# Altium project ESP32_Pico.PrjPcb
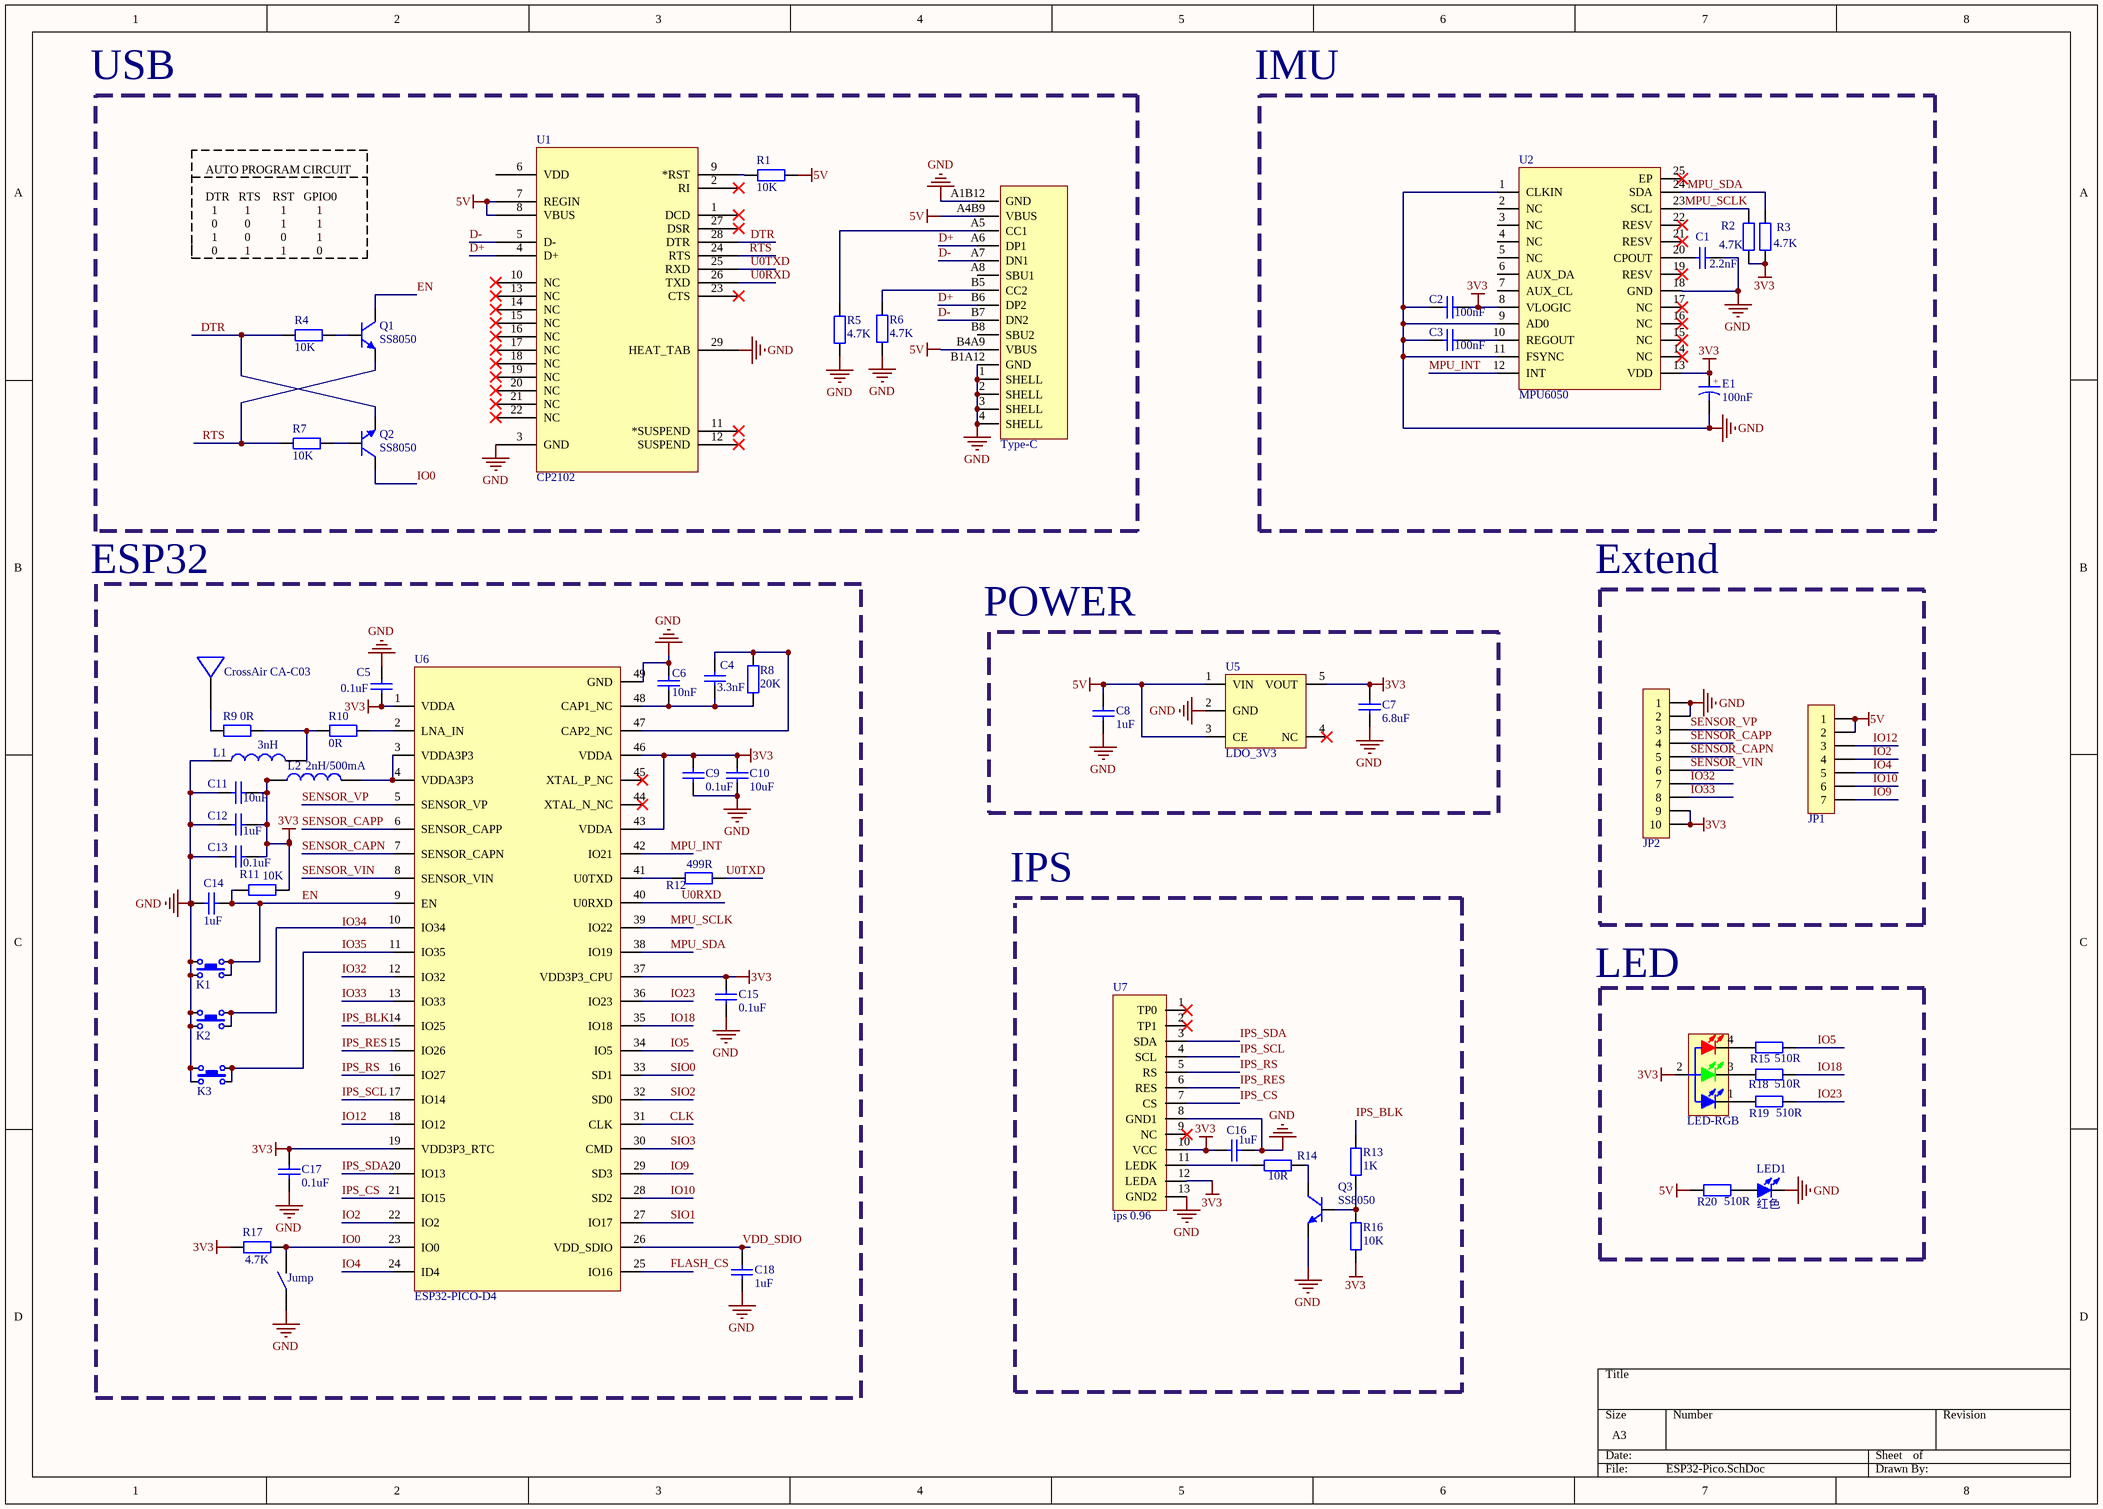
[diagram p0: ESP32-Pico.SchDoc]
1 sheet, 59 parts. Net scope: global (net labels, ports and power ports of the same name join across sheets).
Board file: ESP32-Pico.PcbDoc

## Sheet ESP32-Pico.SchDoc
size A3; SheetNumber: 1; SheetTotal: 1

### Parts
*1  Jump  [Jump]
C1  2.2nF  [C0402_L]
C2  100nF  [C0402_L]
C3  100nF  [C0402_L]
C4  3.3nF  [C0402_L]
C5  0.1uF  [C0402_L]
C6  10nF  [C0402_L]
C7  6.8uF  [C0603_L]
C8  1uF  [C0402_L]
C9  0.1uF  [C0402_L]
C10  10uF  [C0402_L]
C11  10uF  [C0402_L]
C12  1uF  [C0402_L]
C13  0.1uF  [C0402_L]
C14  1uF  [C0402_L]
C15  0.1uF  [C0402_L]
C16  1uF  [C0402_L]
C17  0.1uF  [C0402_L]
C18  1uF  [C0402_L]
E1  100nF  [C_3216]
JP1  HDR-1X7  [HDR2.54-7P]  (value not drawn)
JP2  HDR-1X10  [HDR2.54-10P]  (value not drawn)
K1  (no value)  [ButtonTACT_3.5*3.55_90]
K2  (no value)  [ButtonTACT_3.5*3.55_90]
K3  (no value)  [ButtonTACT_3.5*3.55_90]
L1  3nH  [L0402]
L2  2nH/500mA  [L0402]
LED1  红色  [LED0402]
Q1  SS8050  [SOT23-3N]
Q2  SS8050  [SOT23-3N]
Q3  SS8050  [SOT23-3N]
R1  10K  [R0402_L]
R2  4.7K  [R0402_L]
R3  4.7K  [R0402_L]
R4  10K  [R0402_L]
R5  4.7K  [R0402_L]
R6  4.7K  [R0402_L]
R7  10K  [R0402_L]
R8  20K  [R0402_L]
R9  0R  [R0402_L]
R10  0R  [R0402_L]
R11  10K  [R0402_L]
R12  499R  [R0402_L]
R13  1K  [R0402_L]
R14  10R  [R0603_L]
R15  510R  [R0402_L]
R16  10K  [R0402_L]
R17  4.7K  [R0402_L]
R18  510R  [R0402_L]
R19  510R  [R0402_L]
R20  510R  [R0402_L]
U1  CP2102  [CP2102]
U2  MPU6050  [MPU6050]
U3  Type-C  [Type-C 16P]
U4  CrossAir CA-C03  [CrossAir CA-C03]
U5  LDO_3V3  [SSP7603P33M5R]
U6  ESP32-PICO-D4  [ESP32-PICO-D4]
U7  ips 0.96  [ips 0.96]
U8  LED-RGB  [LED-RGB]

### Nets
3V3: C2.1 C5.2 C7.2 C9.2 C10.2 C11.2 C12.2 C13.2 C15.2 C16.1 C17.2 E1.1(A) JP2.9 JP2.10 L2.1 R2.2 R3.2 R11.2 R16.2 R17.1 U2.8(VLOGIC) U2.13(VDD) U5.5(VOUT) U6.1(VDDA) U6.19(VDD3P3_RTC) U6.37(VDD3P3_CPU) U6.43(VDDA) U6.46(VDDA) U7.10(VCC) U7.12(LEDA) U8.2(A)
5V: C8.2 JP1.1 JP1.2 R1.2 R20.1 U1.7(REGIN) U1.8(VBUS) U3.A4B9(VBUS) U3.B4A9(VBUS) U5.1(VIN) U5.3(CE)
GND: *1.1 C1.2 C2.2 C3.2 C5.1 C6.1 C7.1 C8.1 C9.1 C10.1 C11.1 C12.1 C13.1 C14.2 C15.1 C16.2 C17.1 C18.2 E1.2(K) JP2.1 JP2.2 K1.1 K1.3 K2.1 K2.3 K3.1 K3.3 L1.1 LED1.2(K) Q3.2(E) R5.2 R6.2 U1.3(GND) U1.29(HEAT_TAB) U2.1(CLKIN) U2.9(AD0) U2.11(FSYNC) U2.18(GND) U3.1(SHELL) U3.2(SHELL) U3.3(SHELL) U3.4(SHELL) U3.A1B12(GND) U3.B1A12(GND) U5.2(GND) U6.49(GND) U7.8(GND1) U7.13(GND2)
CLK: U6.31(CLK)
D+: U1.4(D+) U3.A6(DP1) U3.B6(DP2)
D-: U1.5(D-) U3.A7(DN1) U3.B7(DN2)
DTR: Q2.2(E) R4.2 U1.28(DTR)
EN: C14.1 K1.2 K1.4 Q1.3(C) R11.1 U6.9(EN)
IO0: *1.2 Q2.3(C) R17.2 U6.23(IO0)
IO2: JP1.4 U6.22(IO2)
IO4: JP1.5 U6.24(ID4)
IO5: R15.2 U6.34(IO5)
IO9: JP1.7 U6.29(SD3)
IO10: JP1.6 U6.28(SD2)
IO12: JP1.3 U6.18(IO12)
IO18: R18.2 U6.35(IO18)
IO23: R19.2 U6.36(IO23)
IO32: JP2.7 U6.12(IO32)
IO33: JP2.8 U6.13(IO33)
IO35: K3.2 K3.4 U6.11(IO35)
IPS_BLK: R13.2 U6.14(IO25)
IPS_CS: U6.21(IO15) U7.7(CS)
IPS_RES: U6.15(IO26) U7.6(RES)
IPS_RS: U6.16(IO27) U7.5(RS)
IPS_SCL: U6.17(IO14) U7.4(SCL)
IPS_SDA: U6.20(IO13) U7.3(SDA)
MPU_INT: U2.12(INT) U6.42(IO21)
MPU_SCLK: R2.1 U2.23(SCL) U6.39(IO22)
MPU_SDA: R3.1 U2.24(SDA) U6.38(IO19)
RTS: Q1.2(E) R7.2 U1.24(RTS)
SENSOR_CAPN: JP2.5 U6.7(SENSOR_CAPN)
SENSOR_CAPP: JP2.4 U6.6(SENSOR_CAPP)
SENSOR_VIN: JP2.6 U6.8(SENSOR_VIN)
SENSOR_VP: JP2.3 U6.5(SENSOR_VP)
SIO0: U6.33(SD1)
SIO1: U6.27(IO17)
SIO2: U6.32(SD0)
SIO3: U6.30(CMD)
U0RXD: U1.26(TXD) U6.40(U0RXD)
U0TXD: R12.2 U1.25(RXD)
VDD_SDIO: C18.1 U6.26(VDD_SDIO)
NetC1_1: C1.1 U2.20(CPOUT)
NetC3_1: C3.1 U2.10(REGOUT)
NetC4_1: C4.1 R8.1 U6.47(CAP2_NC)
NetC4_2: C4.2 C6.2 R8.2 U6.48(CAP1_NC)
NetK2_2: K2.2 K2.4 U6.10(IO34)
NetL1_2: L1.2 R9.1 R10.1
NetL2_2: L2.2 U6.3(VDDA3P3) U6.4(VDDA3P3)
NetLED1_1: LED1.1(A) R20.2
NetQ1_1: Q1.1(B) R4.1
NetQ2_1: Q2.1(B) R7.1
NetQ3_1: Q3.1(B) R13.1 R16.1
NetQ3_3: Q3.3(C) R14.2
NetR1_1: R1.1 U1.9(*RST)
NetR5_1: R5.1 U3.A5(CC1)
NetR6_1: R6.1 U3.B5(CC2)
NetR9_2: R9.2 U4.1
NetR10_2: R10.2 U6.2(LNA_IN)
NetR12_1: R12.1 U6.41(U0TXD)
NetR14_1: R14.1 U7.11(LEDK)
NetR15_1: R15.1 U8.4(RED_K)
NetR18_1: R18.1 U8.3(GREEN_K)
NetR19_1: R19.1 U8.1(BULE_K)

Not connected (* = marked no-connect by the designer): U1 1(DCD)* 2(RI)* 6(VDD) 10(NC)* 11(*SUSPEND)* 12(SUSPEND)* 13(NC)* 14(NC)* 15(NC)* 16(NC)* 17(NC)* 18(NC)* 19(NC)* 20(NC)* 21(NC)* 22(NC)* 23(CTS)* 27(DSR)*; U2 2(NC) 3(NC) 4(NC) 5(NC) 6(AUX_DA) 7(AUX_CL) 14(NC)* 15(NC)* 16(NC)* 17(NC)* 19(RESV)* 21(RESV)* 22(RESV)* 25(EP)*; U3 A8(SBU1) B8(SBU2); U5 4(NC)*; U6 25(IO16) 44(XTAL_N_NC)* 45(XTAL_P_NC)*; U7 1(TP0)* 2(TP1)* 9(NC)*

### Notes on the sheet
- USB
- IMU
- AUTO PROGRAM CIRCUIT
  DTR   RTS    RST   GPIO0
  1         1          1          1
  0         0          1          1
  1         0          0          1
  0         1          1          0
- ESP32
- Extend
- POWER
- IPS
- LED
- Labels drawn without touching a wire or pin: FLASH_CS, IO34
- (in symbol CT) +

### Library data of the parts
C1-C18 = C: 贴片电容; BOM名称: 无极性贴片电容; 联系卖家，免费查找封装: 唯一出售店铺网址https://shop463601444.taobao.com
E1 = CT: 贴片钽电容; 联系卖家，免费查找封装: 唯一出售店铺网址https://shop463601444.taobao.com; 封装库来自淘宝卖家ID：黄晶宝石: 其他店铺购入均为盗版假冒封装库，请立即申请退款; BOM名称: 贴片钽电容
JP1 = Header 7: 7P接插件; 封装库来自淘宝卖家 ID：黄晶宝石: 其他店铺购入均为盗版假冒封装库; 联系卖家，免费查找封装: 唯一出售店铺网址https://shop463601444.taobao.com; BOM名称: 7P接插件
JP2 = Header 10: 10P接插件; 封装库来自淘宝卖家 ID：黄晶宝石: 其他店铺购入均为盗版假冒封装库; 联系卖家，免费查找封装: 唯一出售店铺网址https://shop463601444.taobao.com; BOM名称: 10P接插件
K1-K3 = ButtonTACT: Button
L1 L2 = L: 贴片小功率电感; BOM名称: 小功率贴片电感; 联系卖家，免费查找封装: 唯一出售店铺网址https://shop463601444.taobao.com; 封装库来自淘宝卖家ID：黄晶宝石: 其他店铺购入均为盗版假冒封装库，请立即申请退款
LED1 = LED-SMD: 贴片LED; 封装库来自淘宝卖家 ID：黄晶宝石: 其他店铺购入均为假冒，请立即申请退款，本店奖励现金5~20元; BOM名称: 贴片LED
Q1-Q3 = 8050-SMD: 高频放大-NPN型; 联系卖家，免费查找封装: 唯一出售店铺网址https://shop463601444.taobao.com; 封装库来自淘宝卖家 ID：黄晶宝石: 其他店铺购入均为盗版，不享受售后技术支持服务，请立即申请退款; 参数: 40V 1.5A 1W 100MHZ; BOM名称: 高频放大-NPN型
R1-R20 = R: 贴片电阻; 联系卖家，免费查找封装: 唯一出售店铺网址https://shop463601444.taobao.com; 封装库来自淘宝卖家ID：黄晶宝石: 其他店铺购入均为盗版假冒封装库，请立即申请退款; BOM名称: 贴片电阻
U1 = CP2102: USB转TTL; PART DESC: SINGLE-CHIP USB TO UART BRIDGE, QFN28, RoHS.; MFG #1: SILICON LABS; PART NUMBER: CP2102; Value: Value; RefDes: RefDes; Type: DEV
U2 = MPU6050_6050
U4 = CrossAir CA-C03: BOM名称: PCB板载天线; 版权归属: 源创客; 学习资源: www.ooocke.com
U5 = SSP7603P33M5R: ID:C411031
U6 = ESP32-PICO-D4: ID:C193707
U7 = ips 0.96: 中景园 ips 0.96寸TFT显示屏ips液晶屏0.96寸st7735 ips显示屏 TFT LCD